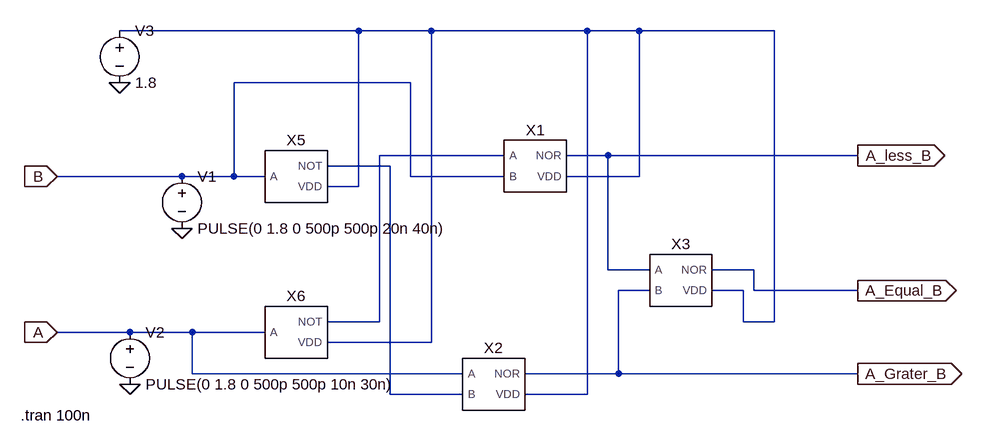
[diagram p0: schematic TG_recheck.asc]
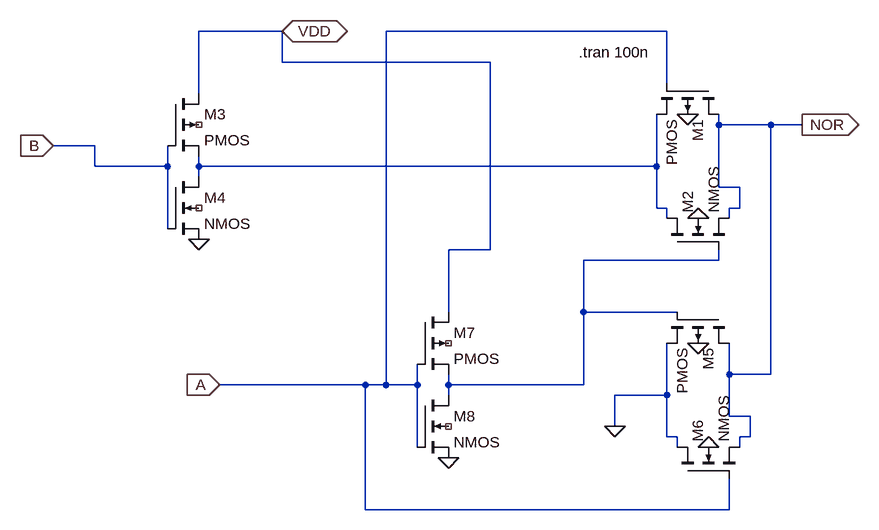
[diagram p1: sub-circuit nor.asc]
TG_recheck.asc, the LTspice schematic file:
Version 4
SHEET 1 908 680
WIRE -16 -160 -384 -160
WIRE 96 -160 -16 -160
WIRE 336 -160 96 -160
WIRE 416 -160 336 -160
WIRE 624 -160 416 -160
WIRE 64 -80 -208 -80
WIRE 208 32 16 32
WIRE 368 32 304 32
WIRE 752 32 368 32
WIRE 32 48 -64 48
WIRE -288 64 -480 64
WIRE -208 64 -208 -80
WIRE -208 64 -288 64
WIRE -160 64 -208 64
WIRE 64 64 64 -80
WIRE 208 64 64 64
WIRE 416 64 416 -160
WIRE 416 64 304 64
WIRE -16 80 -16 -160
WIRE -16 80 -64 80
WIRE 368 208 368 32
WIRE 432 208 368 208
WIRE 592 208 528 208
WIRE 432 240 384 240
WIRE 576 240 528 240
WIRE 592 240 592 208
WIRE 752 240 592 240
WIRE 16 288 16 32
WIRE 16 288 -64 288
WIRE 576 288 576 240
WIRE 624 288 624 -160
WIRE 624 288 576 288
WIRE -368 304 -480 304
WIRE -272 304 -368 304
WIRE -160 304 -272 304
WIRE 96 320 96 -160
WIRE 96 320 -64 320
WIRE -272 368 -272 304
WIRE 144 368 -272 368
WIRE 384 368 384 240
WIRE 384 368 240 368
WIRE 752 368 384 368
WIRE 32 400 32 48
WIRE 144 400 32 400
WIRE 336 400 336 -160
WIRE 336 400 240 400
FLAG -480 64 B
IOPIN -480 64 In
FLAG -480 304 A
IOPIN -480 304 In
FLAG -384 -80 0
FLAG -288 144 0
FLAG -368 384 0
FLAG 752 32 A_less_B
IOPIN 752 32 Out
FLAG 752 368 A_Grater_B
IOPIN 752 368 Out
FLAG 752 240 A_Equal_B
IOPIN 752 240 Out
SYMBOL NOT_VDD -112 64 R0
SYMATTR InstName X5
SYMBOL NOT_VDD -112 304 R0
SYMATTR InstName X6
SYMBOL voltage -288 48 R0
WINDOW 123 0 0 Left 0
WINDOW 39 0 0 Left 0
SYMATTR InstName V1
SYMATTR Value PULSE(0 1.8 0 500p 500p 20n 40n)
SYMBOL voltage -368 288 R0
WINDOW 123 0 0 Left 0
WINDOW 39 0 0 Left 0
SYMATTR InstName V2
SYMATTR Value PULSE(0 1.8 0 500p 500p 10n 30n)
SYMBOL voltage -384 -176 R0
WINDOW 123 0 0 Left 0
WINDOW 39 0 0 Left 0
SYMATTR InstName V3
SYMATTR Value 1.8
SYMBOL NOR 480 224 R0
SYMATTR InstName X3
SYMBOL NOR 256 48 R0
SYMATTR InstName X1
SYMBOL NOR 192 384 R0
SYMATTR InstName X2
TEXT -536 432 Left 2 !.tran 100n

nor.asc, the sub-circuit schematic file:
Version 4
SHEET 1 880 756
WIRE -384 16 -512 16
WIRE 208 16 -224 16
WIRE -384 64 -384 16
WIRE -64 64 -384 64
WIRE 208 96 208 16
WIRE -512 112 -512 16
WIRE 288 160 288 144
WIRE 368 160 288 160
WIRE 416 160 368 160
WIRE -672 192 -736 192
WIRE -672 224 -672 192
WIRE -560 224 -560 192
WIRE -560 224 -672 224
WIRE -512 224 -512 208
WIRE 192 224 192 144
WIRE 192 224 -512 224
WIRE -512 240 -512 224
WIRE 288 256 288 160
WIRE 320 256 288 256
WIRE 192 288 192 224
WIRE 208 288 192 288
WIRE 320 288 320 256
WIRE 320 288 304 288
WIRE 208 304 208 288
WIRE 304 304 304 288
WIRE -560 320 -560 224
WIRE -64 352 -64 64
WIRE -64 352 -128 352
WIRE 288 368 288 352
WIRE 288 368 80 368
WIRE -128 448 -128 352
WIRE 80 448 80 368
WIRE 224 448 80 448
WIRE 304 544 304 496
WIRE 368 544 368 160
WIRE 368 544 304 544
WIRE -256 560 -480 560
WIRE -224 560 -224 16
WIRE -224 560 -256 560
WIRE -176 560 -176 528
WIRE -176 560 -224 560
WIRE -128 560 -128 544
WIRE 80 560 80 448
WIRE 80 560 -128 560
WIRE -128 576 -128 560
WIRE 208 576 208 496
WIRE 208 576 128 576
WIRE 304 608 304 544
WIRE 336 608 304 608
WIRE 128 624 128 576
WIRE 208 640 208 576
WIRE 224 640 208 640
WIRE 336 640 336 608
WIRE 336 640 320 640
WIRE -176 656 -176 560
WIRE 224 656 224 640
WIRE 320 656 320 640
WIRE -256 752 -256 560
WIRE 304 752 304 704
WIRE 304 752 -256 752
FLAG -480 560 A
IOPIN -480 560 In
FLAG -736 192 B
IOPIN -736 192 In
FLAG 416 160 NOR
IOPIN 416 160 Out
FLAG 240 144 0
FLAG 256 304 0
FLAG 256 496 0
FLAG 272 656 0
FLAG -128 672 0
FLAG -512 336 0
FLAG 128 624 0
FLAG -384 16 VDD
IOPIN -384 16 BiDir
SYMBOL pmos4 288 96 R90
SYMATTR InstName M1
SYMBOL nmos4 208 352 R270
SYMATTR InstName M2
SYMBOL pmos4 304 448 R90
SYMATTR InstName M5
SYMBOL nmos4 224 704 R270
SYMATTR InstName M6
SYMBOL pmos4 -176 448 R0
SYMATTR InstName M7
SYMBOL nmos4 -176 576 R0
SYMATTR InstName M8
SYMBOL pmos4 -560 112 R0
SYMATTR InstName M3
SYMBOL nmos4 -560 240 R0
SYMATTR InstName M4
TEXT 72 48 Left 2 !.tran 100n

The netlist it stands for:
* TG_recheck.asc
XX5 B N003 N001 NOT_VDD  ; pins A NOT VDD
XX6 A N002 N001 NOT_VDD  ; pins A NOT VDD
V1 B 0 PULSE(0 1.8 0 500p 500p 20n 40n)
V2 A 0 PULSE(0 1.8 0 500p 500p 10n 30n)
V3 N001 0 1.8
XX3 A_less_B A_Grater_B A_Equal_B N001 nor
XX1 N002 B A_less_B N001 nor
XX2 A N003 A_Grater_B N001 nor

* block symbol definitions
.subckt nor A B NOR VDD
M1 NOR A N001 0 PMOS
M2 N001 N002 NOR 0 NMOS
M5 NOR N002 0 0 PMOS
M6 0 A NOR 0 NMOS
M7 VDD A N002 NC_01 PMOS
M8 N002 A 0 NC_02 NMOS
M3 VDD B N001 NC_03 PMOS
M4 N001 B 0 NC_04 NMOS
.tran 100n
.ends nor

.model NMOS NMOS
.model PMOS PMOS
.lib standard.mos
.tran 100n
.backanno
.end